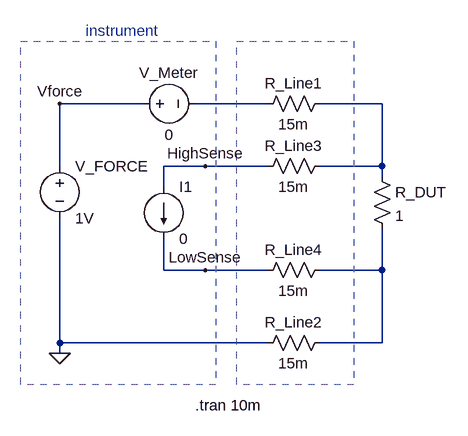
[diagram p0: schematic FVMI_mode_kelvin4wire_measureResistance.asc]
FVMI_mode_kelvin4wire_measureResistance.asc, the LTspice schematic file:
Version 4
SHEET 1 880 680
WIRE 0 80 -128 80
WIRE 192 80 80 80
WIRE 368 80 272 80
WIRE -128 176 -128 80
WIRE 96 176 32 176
WIRE 192 176 96 176
WIRE 368 176 368 80
WIRE 368 176 272 176
WIRE 368 192 368 176
WIRE 32 208 32 176
WIRE 32 336 32 288
WIRE 96 336 32 336
WIRE 192 336 96 336
WIRE 368 336 368 272
WIRE 368 336 272 336
WIRE -128 448 -128 256
WIRE 192 448 -128 448
WIRE 368 448 368 336
WIRE 368 448 272 448
WIRE -128 464 -128 448
FLAG -128 464 0
FLAG -128 80 Vforce
FLAG 96 176 HighSense
FLAG 96 336 LowSense
SYMBOL voltage -128 160 R0
SYMATTR InstName V_FORCE
SYMATTR Value 1V
SYMBOL voltage -16 80 R270
WINDOW 0 32 56 VTop 2
WINDOW 3 -32 56 VBottom 2
SYMATTR InstName V_Meter
SYMATTR Value 0
SYMBOL res 176 96 R270
WINDOW 0 32 56 VTop 2
WINDOW 3 0 56 VBottom 2
SYMATTR InstName R_Line1
SYMATTR Value 15m
SYMBOL res 176 464 R270
WINDOW 0 32 56 VTop 2
WINDOW 3 0 56 VBottom 2
SYMATTR InstName R_Line2
SYMATTR Value 15m
SYMBOL res 352 176 R0
SYMATTR InstName R_DUT
SYMATTR Value 1
SYMBOL current 32 208 R0
SYMATTR InstName I1
SYMATTR Value 0
SYMBOL Res 288 160 R90
WINDOW 0 0 56 VBottom 2
WINDOW 3 32 56 VTop 2
SYMATTR InstName R_Line3
SYMATTR Value 15m
SYMBOL Res 288 320 R90
WINDOW 0 0 56 VBottom 2
WINDOW 3 32 56 VTop 2
SYMATTR InstName R_Line4
SYMATTR Value 15m
TEXT 80 544 Left 2 !.tran 10m
TEXT -88 -32 Left 2 ;instrument
RECTANGLE Normal -188 -16 112 512 2
RECTANGLE Normal 144 -16 324 512 2

The netlist it stands for:
* FVMI_mode_kelvin4wire_measureResistance.asc
V_FORCE Vforce 0 1V
V_Meter Vforce N001 0
R_Line1 N001 N002 15m
R_Line2 0 N003 15m
R_DUT N002 N003 1
I1 HighSense LowSense 0
R_Line3 N002 HighSense 15m
R_Line4 N003 LowSense 15m
.tran 10m
* instrument
.backanno
.end